# Altium schematic sheet WikiTFT-2.8.SchDoc
size A4
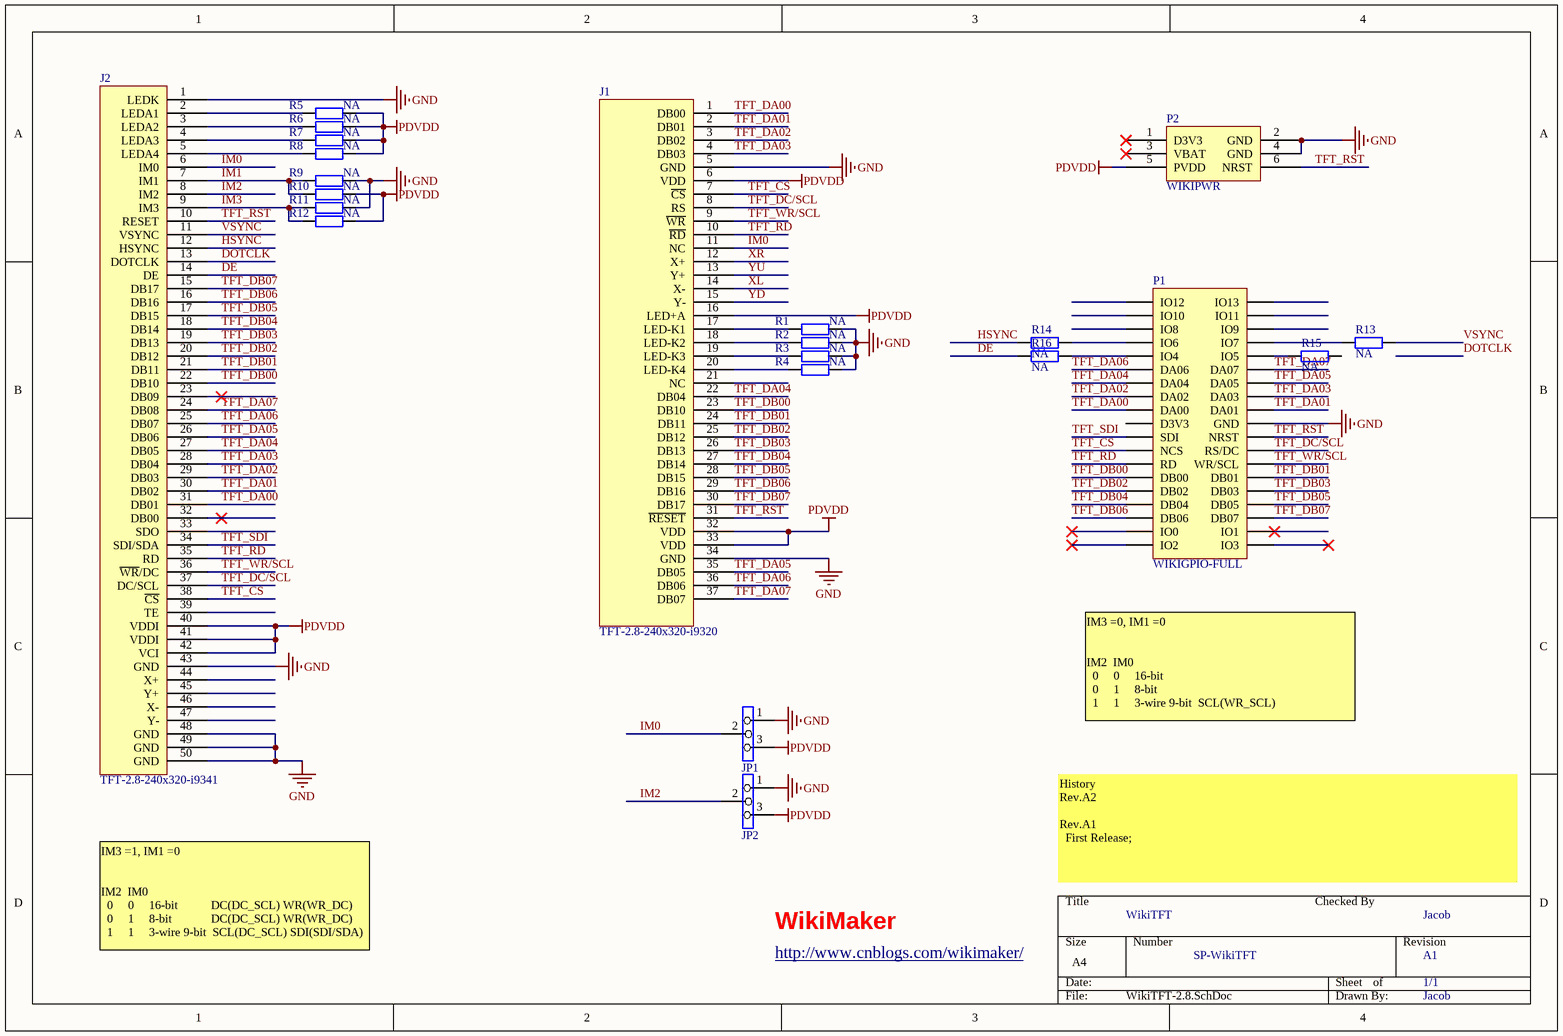
[diagram p0: WikiTFT-2.8.SchDoc]

## Parts
J1  TFT-2.8-240x320-i9320  [TFT-PIN37-1.0MM]
J2  TFT-2.8-240x320-i9341  [FPC-0.5-PIN50]
JP1  Jumper3  [HDR1X3/2.00mm]  (value not drawn)
JP2  Jumper3  [HDR1X3/2.00mm]  (value not drawn)
P1  WIKIGPIO-FULL  [WIKIGPIO-FULL]
P2  WIKIPWR  [WIKIPWR]
R1  NA  [0603M]
R2  NA  [0603M]
R3  NA  [0603M]
R4  NA  [0603M]
R5  NA  [0603M]
R6  NA  [0603M]
R7  NA  [0603M]
R8  NA  [0603M]
R9  NA  [0603M]
R10  NA  [0603M]
R11  NA  [0603M]
R12  NA  [0603M]
R13  NA  [0603M]
R14  NA  [0603M]
R15  NA  [0603M]
R16  NA  [0603M]

## Nets
GND: J1.5(GND) J1.34(GND) J2.1(LEDK) J2.43(GND) J2.48(GND) J2.49(GND) J2.50(GND) JP1.1 JP2.1 P1.20(GND) P2.2(GND) P2.4(GND) R1.1 R2.1 R3.1 R4.1 R9.1 R11.1
PDVDD: J1.6(VDD) J1.16(LED+A) J1.32(VDD) J1.33(VDD) J2.40(VDDI) J2.41(VDDI) J2.42(VCI) JP1.3 JP2.3 P2.5(PVDD) R5.1 R6.1 R7.1 R8.1 R10.1 R12.1
DE: J2.14(DE) R16.1
DOTCLK: J2.13(DOTCLK)
HSYNC: J2.12(HSYNC) R14.1
IM0: J1.11(NC) J2.6(IM0) JP1.2
IM1: J2.7(IM1) R9.2 R10.2
IM2: J2.8(IM2) JP2.2
IM3: J2.9(IM3) R11.2 R12.2
TFT_CS: J1.7(~{CS}) J2.38(~{CS}) P1.23(NCS)
TFT_DA00: J1.1(DB00) J2.31(DB01) P1.17(DA00)
TFT_DA01: J1.2(DB01) J2.30(DB02) P1.18(DA01)
TFT_DA02: J1.3(DB02) J2.29(DB03) P1.15(DA02)
TFT_DA03: J1.4(DB03) J2.28(DB04) P1.16(DA03)
TFT_DA04: J1.22(DB04) J2.27(DB05) P1.13(DA04)
TFT_DA05: J1.35(DB05) J2.26(DB06) P1.14(DA05)
TFT_DA06: J1.36(DB06) J2.25(DB07) P1.11(DA06)
TFT_DA07: J1.37(DB07) J2.24(DB08) P1.12(DA07)
TFT_DB00: J1.23(DB10) J2.22(DB10) P1.27(DB00)
TFT_DB01: J1.24(DB11) J2.21(DB11) P1.28(DB01)
TFT_DB02: J1.25(DB12) J2.20(DB12) P1.29(DB02)
TFT_DB03: J1.26(DB13) J2.19(DB13) P1.30(DB03)
TFT_DB04: J1.27(DB14) J2.18(DB14) P1.31(DB04)
TFT_DB05: J1.28(DB15) J2.17(DB15) P1.32(DB05)
TFT_DB06: J1.29(DB16) J2.16(DB16) P1.33(DB06)
TFT_DB07: J1.30(DB17) J2.15(DB17) P1.34(DB07)
TFT_DC/SCL: J1.8(RS) J2.37(DC/SCL) P1.24(RS/DC)
TFT_RD: J1.10(~{RD}) J2.35(RD) P1.25(RD)
TFT_RST: J1.31(~{RESET}) J2.10(RESET) P1.22(NRST) P2.6(NRST)
TFT_SDI: J2.34(SDI/SDA) P1.21(SDI)
TFT_WR/SCL: J1.9(~{WR}) J2.36(~{WR}/DC) P1.26(WR/SCL)
VSYNC: J2.11(VSYNC) R13.2
XL: J1.14(X-)
XR: J1.12(X+)
YD: J1.15(Y-)
YU: J1.13(Y+)
NetJ1_17: J1.17(LED-K1) R1.2
NetJ1_18: J1.18(LED-K2) R2.2
NetJ1_19: J1.19(LED-K3) R3.2
NetJ1_20: J1.20(LED-K4) R4.2
NetJ2_2: J2.2(LEDA1) R5.2
NetJ2_3: J2.3(LEDA2) R6.2
NetJ2_4: J2.4(LEDA3) R7.2
NetJ2_5: J2.5(LEDA4) R8.2
NetP1_7: P1.7(IO6) R14.2
NetP1_8: P1.8(IO7) R13.1
NetP1_9: P1.9(IO4) R16.2
NetP1_10: P1.10(IO5) R15.1

Not connected (* = marked no-connect by the designer): J1 21(NC); J2 23(DB09)* 32(DB00)* 33(SDO) 39(TE) 44(X+) 45(Y+) 46(X-) 47(Y-); P1 1(IO12) 2(IO13) 3(IO10) 4(IO11) 5(IO8) 6(IO9) 19(D3V3) 35(IO0)* 36(IO1)* 37(IO2)* 38(IO3)*; P2 1(D3V3)* 3(VBAT)*; R15 2

## Notes on the sheet
- IM3 =0, IM1 =0
  IM2  IM0
  0     0     16-bit
  0     1     8-bit
  1     1     3-wire 9-bit  SCL(WR_SCL)
- History
  Rev.A2
  Rev.A1
  First Release;
- WikiTFT
- Checked By
- Jacob
- IM3 =1, IM1 =0
  IM2  IM0
  0     0     16-bit           DC(DC_SCL) WR(WR_DC)
  0     1     8-bit             DC(DC_SCL) WR(WR_DC)
  1     1     3-wire 9-bit  SCL(DC_SCL) SDI(SDI/SDA)
- http://www.cnblogs.com/wikimaker/
- WikiMaker
- SP-WikiTFT
- A1
- 1/1

## Library data of the parts
J1 = TFT-2.8-240x320-i9320: i9320-240x320
J2 = TFT-2.8-240x320-i9341-PIN50-FPC
P1 = WIKIGPIO-FULL: Header, 19-Pin, Dual row; LatestRevisionDate: 17-Jul-2002; LatestRevisionNote: Re-released for DXP Platform.; Publisher: Altium Limited
P2 = WIKIPWR: PWR HDR
R1-R16 = Res: Resistor; Published: 8-Jun-2000; LatestRevisionDate: 17-Jul-2002; LatestRevisionNote: Re-released for DXP Platform.; PackageReference: AXIAL-0.4; Publisher: Altium Limited; Value: NA